# Altium schematic sheet Communication_with_IO.SchDoc
size A4; SheetNumber: 1; SheetTotal: 9
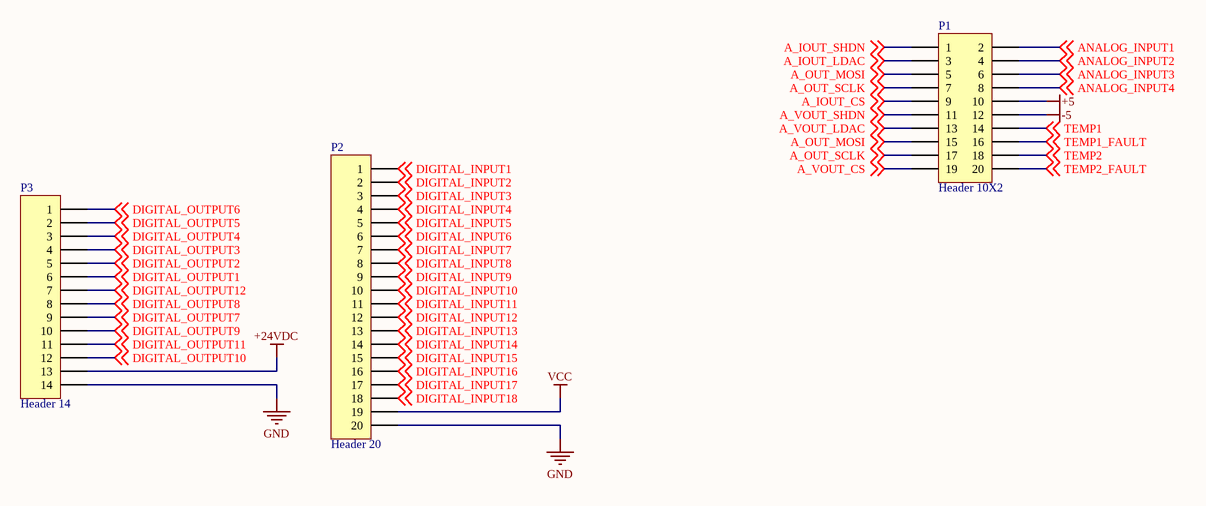
[diagram p0: Communication_with_IO.SchDoc]

## Parts
P1  Header 10X2  [HDR2X10]
P2  Header 20  [HDR1X20]
P3  Header 14  [HDR1X14]

## Nets
+5: P1.10
+24VDC: P3.13
-5: P1.12
GND: P2.20 P3.14
VCC: P2.19
A_IOUT_CS: P1.9 ; off-sheet A_IOUT_CS
A_IOUT_LDAC: P1.3 ; off-sheet A_IOUT_LDAC
A_IOUT_SHDN: P1.1 ; off-sheet A_IOUT_SHDN
A_OUT_MOSI: P1.5 P1.15 ; off-sheet A_OUT_MOSI
A_OUT_SCLK: P1.7 P1.17 ; off-sheet A_OUT_SCLK
A_VOUT_CS: P1.19 ; off-sheet A_VOUT_CS
A_VOUT_LDAC: P1.13 ; off-sheet A_VOUT_LDAC
A_VOUT_SHDN: P1.11 ; off-sheet A_VOUT_SHDN
ANALOG_INPUT1: P1.2 ; off-sheet ANALOG_INPUT1
ANALOG_INPUT2: P1.4 ; off-sheet ANALOG_INPUT2
ANALOG_INPUT3: P1.6 ; off-sheet ANALOG_INPUT3
ANALOG_INPUT4: P1.8 ; off-sheet ANALOG_INPUT4
DIGITAL_INPUT1: P2.1 ; off-sheet DIGITAL_INPUT1
DIGITAL_INPUT2: P2.2 ; off-sheet DIGITAL_INPUT2
DIGITAL_INPUT3: P2.3 ; off-sheet DIGITAL_INPUT3
DIGITAL_INPUT4: P2.4 ; off-sheet DIGITAL_INPUT4
DIGITAL_INPUT5: P2.5 ; off-sheet DIGITAL_INPUT5
DIGITAL_INPUT6: P2.6 ; off-sheet DIGITAL_INPUT6
DIGITAL_INPUT7: P2.7 ; off-sheet DIGITAL_INPUT7
DIGITAL_INPUT8: P2.8 ; off-sheet DIGITAL_INPUT8
DIGITAL_INPUT9: P2.9 ; off-sheet DIGITAL_INPUT9
DIGITAL_INPUT10: P2.10 ; off-sheet DIGITAL_INPUT10
DIGITAL_INPUT11: P2.11 ; off-sheet DIGITAL_INPUT11
DIGITAL_INPUT12: P2.12 ; off-sheet DIGITAL_INPUT12
DIGITAL_INPUT13: P2.13 ; off-sheet DIGITAL_INPUT13
DIGITAL_INPUT14: P2.14 ; off-sheet DIGITAL_INPUT14
DIGITAL_INPUT15: P2.15 ; off-sheet DIGITAL_INPUT15
DIGITAL_INPUT16: P2.16 ; off-sheet DIGITAL_INPUT16
DIGITAL_INPUT17: P2.17 ; off-sheet DIGITAL_INPUT17
DIGITAL_INPUT18: P2.18 ; off-sheet DIGITAL_INPUT18
DIGITAL_OUTPUT1: P3.6 ; off-sheet DIGITAL_OUTPUT1
DIGITAL_OUTPUT2: P3.5 ; off-sheet DIGITAL_OUTPUT2
DIGITAL_OUTPUT3: P3.4 ; off-sheet DIGITAL_OUTPUT3
DIGITAL_OUTPUT4: P3.3 ; off-sheet DIGITAL_OUTPUT4
DIGITAL_OUTPUT5: P3.2 ; off-sheet DIGITAL_OUTPUT5
DIGITAL_OUTPUT6: P3.1 ; off-sheet DIGITAL_OUTPUT6
DIGITAL_OUTPUT7: P3.9 ; off-sheet DIGITAL_OUTPUT7
DIGITAL_OUTPUT8: P3.8 ; off-sheet DIGITAL_OUTPUT8
DIGITAL_OUTPUT9: P3.10 ; off-sheet DIGITAL_OUTPUT9
DIGITAL_OUTPUT10: P3.12 ; off-sheet DIGITAL_OUTPUT10
DIGITAL_OUTPUT11: P3.11 ; off-sheet DIGITAL_OUTPUT11
DIGITAL_OUTPUT12: P3.7 ; off-sheet DIGITAL_OUTPUT12
TEMP1: P1.14 ; off-sheet TEMP1
TEMP1_FAULT: P1.16 ; off-sheet TEMP1_FAULT
TEMP2: P1.18 ; off-sheet TEMP2
TEMP2_FAULT: P1.20 ; off-sheet TEMP2_FAULT

## Library data of the parts
P1 = Header 10X2: Header, 10-Pin, Dual row; LatestRevisionDate: 17-Jul-2002; LatestRevisionNote: Re-released for DXP Platform.; Publisher: Altium Limited
P2 = Header 20: Header, 20-Pin; LatestRevisionDate: 17-Jul-2002; LatestRevisionNote: Re-released for DXP Platform.; Publisher: Altium Limited
P3 = Header 14: Header, 14-Pin; LatestRevisionDate: 17-Jul-2002; LatestRevisionNote: Re-released for DXP Platform.; Publisher: Altium Limited